# EAGLE design H-Bridge L9110 (EAGLE 9.0.0)
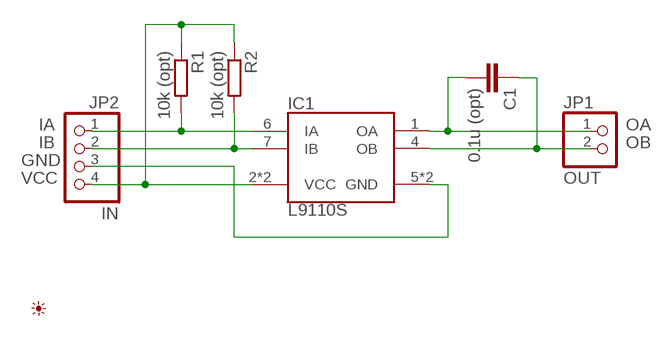
[diagram p0: schematic, sheet 1]

## Parts
C1  0.1u (opt)  C-EUC0805K  [C0805K]
IC1  L9110S  [SO8]
JP1  OUT  PINHD-1X2  [1X02]
JP2  IN  PINHD-1X4  [1X04]
PICTO1  PICTO_1  [PICTO_1]
R1  10k (opt)  R-EU_R0603  [R0603]
R2  10k (opt)  R-EU_R0603  [R0603]

## Nets
GND: IC1.5(GND) IC1.8(GND) JP2.3
IA: IC1.6(IA) JP2.1 R1.2
IB: IC1.7(IB) JP2.2 R2.2
OA: C1.2 IC1.1(OA) JP1.1
OB: C1.1 IC1.4(OB) JP1.2
VCC: IC1.2(VCC) IC1.3(VCC) JP2.4 R1.1 R2.1

## Library data of the parts
C1 = rcl:C-EU: CAPACITOR, European symbol
IC1 = h-bridge:L9110: Motor control driver chip (h-bridge) Voltage range: 2.5V - 12V Continuous current output capability per channel: 800mA
JP1 = pinhead:PINHD-1X2: PIN HEADER
JP2 = pinhead:PINHD-1X4: PIN HEADER
PICTO1 = My_Picto:PICTO_1: Zdenek Brichacek; OK3ZB; http://blog.brichacek.net
R1 R2 = rcl:R-EU_: RESISTOR, European symbol

## Board
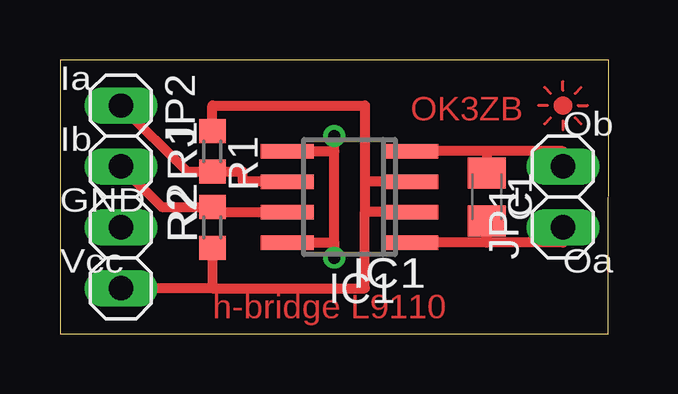
[diagram p1: board, top side]
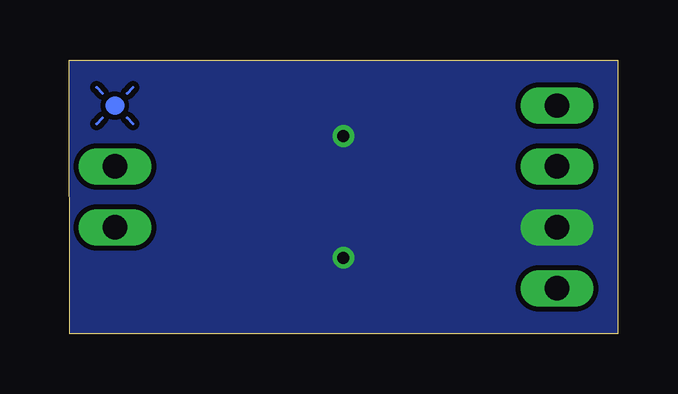
[diagram p2: board, bottom side, seen from below]

Size 22.86 x 11.43 mm. Coordinates in mm from the lower left corner, seen from the top.
Outline: 0,0 22.84,0 22.86,11.43 0,11.43 0,0
Copper layers (1*16): Top 0.035mm / dielectric 1.5mm / Bottom 0.035mm
Design rules "default *": minimum track width 10mil, minimum drill 0.5mm, track to track 8mil, track to pad 8mil, pad to pad 8mil, via to via 8mil, smd to smd 8mil, copper to edge 0mil, drill to drill 8mil, minimum pad ring 10mil, minimum via ring 8mil, stop-mask expansion 4mil, vias tented up to drill 0mil, thermal gap 0mil

### Footprints (pad centres in the part's own frame; a part is rotated, then mirrored left to right if it is on the bottom)
C0805K = smd 1.3 x 1.6: 1 -1,0; 2 1,0
SO8 = smd 0.6 x 2.2: 1 -1.905,-2.6; 2 -0.635,-2.6; 3 0.635,-2.6; 4 1.905,-2.6; 5 1.905,2.6; 6 0.635,2.6; 7 -0.635,2.6; 8 -1.905,2.6
1X02 = drill 1.016 long: 1 -1.27,0; 2 1.27,0
1X04 = drill 1.016 long: 1 -3.81,0; 2 -1.27,0; 3 1.27,0; 4 3.81,0
R0603 = smd 1 x 1.1: 1 -0.85,0; 2 0.85,0

### Placement (x,y rotation side)
C1  17.78,5.71 270 top
IC1  12.06,5.71 90 top
JP1  20.95,5.71 90 top
JP2  2.54,5.71 270 top
PICTO1  20.95,9.53 0 top
R1  6.35,7.62 270 top
R2  6.35,4.45 90 top

### Tracks (layer width: path | path; a pad name or v marks a point on that pad's centre or on a via)
GND  (via drill 0.5)
  Top 0.406: IC1.8 11.43,3.81 | IC1.5 11.43,7.62 | 11.43,3.81 11.43,7.62 | 11.43,3.81 v11.43,3.17 | 11.43,7.62 v11.43,8.26 11.43,8.23
  pour Bottom: 0,11.43 0,0 22.86,0 22.86,11.43
IA
  Top 0.406: IC1.6 7.62,6.35 7.62,6.77 R1.2 5.29,6.77 JP2.1
IB
  Top 0.406: IC1.7 6.35,5.08 R2.2 4.23,5.29 JP2.2
OA
  Top 0.406: 17.78,3.81 IC1.1 | 17.78,3.81 C1.2 | JP1.1 20.95,3.81 17.78,3.81
OB
  Top 0.406: 17.78,7.62 IC1.4 | 17.78,7.62 C1.1 | JP1.2 20.95,7.62 17.78,7.62
VCC
  Top 0.406: IC1.2 12.7,5.08 | 12.7,6.35 12.7,5.08 | IC1.3 12.7,6.35 | 6.35,1.91 JP2.4 | 6.35,1.91 12.7,1.91 12.7,5.08 | R2.1 6.35,1.91 | R1.1 6.35,9.53 12.7,9.53 12.7,6.35

### Text on the board
Top: OK3ZB | h-bridge L9110
_tNames: Ia | R1 | Ib | Ob | C1 | GND | R2 | Vcc | IC1 | Oa